# EAGLE schematic BRAIN2_Breakout_SW (EAGLE 6.6.0)
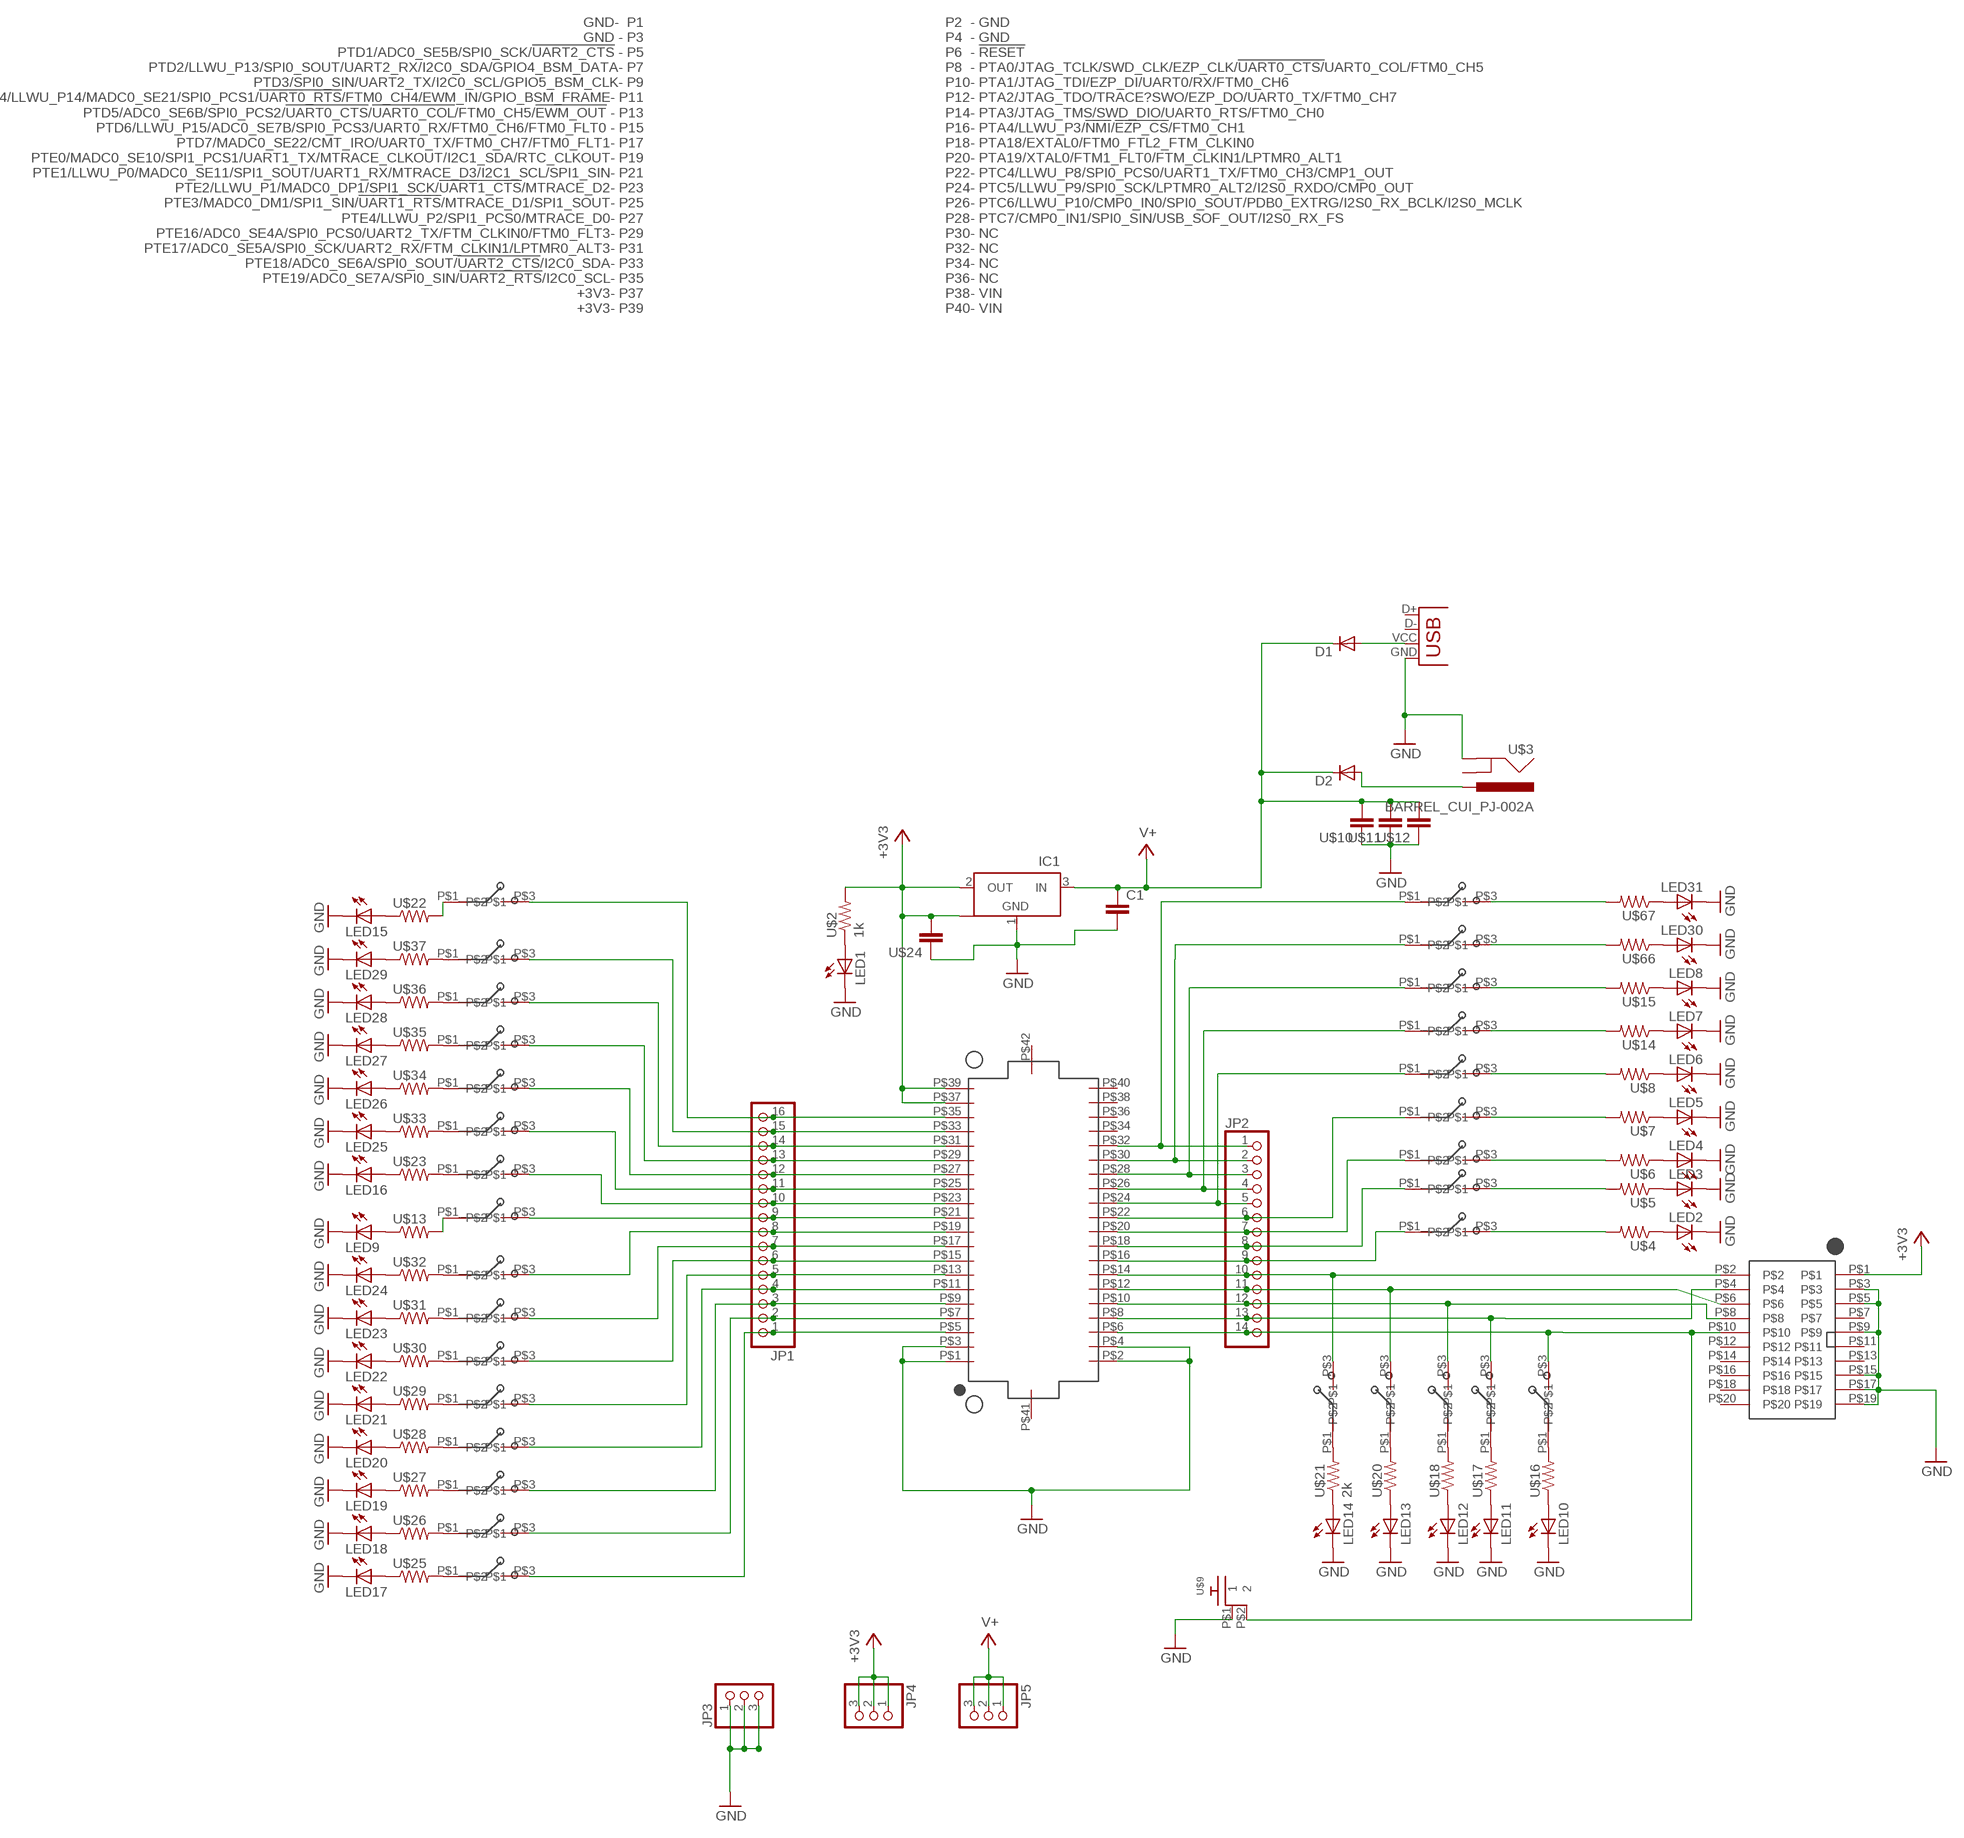
[diagram p0: schematic, sheet 1]

## Parts
C1  RF-C0805  [C0805]
D1  DIODESMA  [SMA-DIODE]
D2  DIODESMA  [SMA-DIODE]
IC1  NCP1117ST33T3G_1  [SOT223]
JP1  PINHD-1X16  [1X16]
JP2  PINHD-1X14  [1X14]
JP3  PINHD-1X3  [1X03]
JP4  PINHD-1X3  [1X03]
JP5  PINHD-1X3  [1X03]
LED1  LEDCHIP-LED0805  [CHIP-LED0805]
LED2  LEDCHIP-LED0805  [CHIP-LED0805]
LED3  LEDCHIP-LED0805  [CHIP-LED0805]
LED4  LEDCHIP-LED0805  [CHIP-LED0805]
LED5  LEDCHIP-LED0805  [CHIP-LED0805]
LED6  LEDCHIP-LED0805  [CHIP-LED0805]
LED7  LEDCHIP-LED0805  [CHIP-LED0805]
LED8  LEDCHIP-LED0805  [CHIP-LED0805]
LED9  LEDCHIP-LED0805  [CHIP-LED0805]
LED10  LEDCHIP-LED0805  [CHIP-LED0805]
LED11  LEDCHIP-LED0805  [CHIP-LED0805]
LED12  LEDCHIP-LED0805  [CHIP-LED0805]
LED13  LEDCHIP-LED0805  [CHIP-LED0805]
LED14  LEDCHIP-LED0805  [CHIP-LED0805]
LED15  LEDCHIP-LED0805  [CHIP-LED0805]
LED16  LEDCHIP-LED0805  [CHIP-LED0805]
LED17  LEDCHIP-LED0805  [CHIP-LED0805]
LED18  LEDCHIP-LED0805  [CHIP-LED0805]
LED19  LEDCHIP-LED0805  [CHIP-LED0805]
LED20  LEDCHIP-LED0805  [CHIP-LED0805]
LED21  LEDCHIP-LED0805  [CHIP-LED0805]
LED22  LEDCHIP-LED0805  [CHIP-LED0805]
LED23  LEDCHIP-LED0805  [CHIP-LED0805]
LED24  LEDCHIP-LED0805  [CHIP-LED0805]
LED25  LEDCHIP-LED0805  [CHIP-LED0805]
LED26  LEDCHIP-LED0805  [CHIP-LED0805]
LED27  LEDCHIP-LED0805  [CHIP-LED0805]
LED28  LEDCHIP-LED0805  [CHIP-LED0805]
LED29  LEDCHIP-LED0805  [CHIP-LED0805]
LED30  LEDCHIP-LED0805  [CHIP-LED0805]
LED31  LEDCHIP-LED0805  [CHIP-LED0805]
U$1  KW2_CPU_NEW  [BRAIN_NEW]
U$2  1k  RF-R0805  [RF-C0805]
U$3  BARREL_CUI_PJ-002A  [BARREL_CUI_PJ-002A]
U$4  RF-R0805  [RF-C0805]
U$5  RF-R0805  [RF-C0805]
U$6  RF-R0805  [RF-C0805]
U$7  RF-R0805  [RF-C0805]
U$8  RF-R0805  [RF-C0805]
U$9  RA_BUTTON  [RA_BUTTON]
U$10  RF-C0805  [C0805]
U$11  RF-C0805  [C0805]
U$12  RF-C0805  [C0805]
U$13  RF-R0805  [RF-C0805]
U$14  RF-R0805  [RF-C0805]
U$15  RF-R0805  [RF-C0805]
U$16  RF-R0805  [RF-C0805]
U$17  RF-R0805  [RF-C0805]
U$18  RF-R0805  [RF-C0805]
U$19  2X10JTAG  [2X10JTAG]
U$20  RF-R0805  [RF-C0805]
U$21  2k  RF-R0805  [RF-C0805]
U$22  RF-R0805  [RF-C0805]
U$23  RF-R0805  [RF-C0805]
U$24  RF-C0805  [C0805]
U$25  RF-R0805  [RF-C0805]
U$26  RF-R0805  [RF-C0805]
U$27  RF-R0805  [RF-C0805]
U$28  RF-R0805  [RF-C0805]
U$29  RF-R0805  [RF-C0805]
U$30  RF-R0805  [RF-C0805]
U$31  RF-R0805  [RF-C0805]
U$32  RF-R0805  [RF-C0805]
U$33  RF-R0805  [RF-C0805]
U$34  RF-R0805  [RF-C0805]
U$35  RF-R0805  [RF-C0805]
U$36  RF-R0805  [RF-C0805]
U$37  RF-R0805  [RF-C0805]
U$38  CJS  [CJS]
U$39  CJS  [CJS]
U$40  CJS  [CJS]
U$41  CJS  [CJS]
U$42  CJS  [CJS]
U$43  CJS  [CJS]
U$44  CJS  [CJS]
U$45  CJS  [CJS]
U$46  CJS  [CJS]
U$47  CJS  [CJS]
U$48  CJS  [CJS]
U$49  CJS  [CJS]
U$50  CJS  [CJS]
U$51  CJS  [CJS]
U$52  CJS  [CJS]
U$53  CJS  [CJS]
U$54  CJS  [CJS]
U$55  CJS  [CJS]
U$56  CJS  [CJS]
U$57  CJS  [CJS]
U$58  CJS  [CJS]
U$59  CJS  [CJS]
U$60  CJS  [CJS]
U$61  CJS  [CJS]
U$62  CJS  [CJS]
U$63  CJS  [CJS]
U$64  CJS  [CJS]
U$65  CJS  [CJS]
U$66  RF-R0805  [RF-C0805]
U$67  RF-R0805  [RF-C0805]
U$68  CJS  [CJS]
U$69  CJS  [CJS]
X1  USB  [USB3076-30-A]

## Nets
+3V3: IC1.2(OUT) IC1.4(OUT1) JP4.1 JP4.2 JP4.3 U$1.P$37(+3V3) U$1.P$39(+3V3) U$2.2 U$19.P$1 U$24.2
GND: C1.2 IC1.1(GND) JP3.1 JP3.2 JP3.3 LED1.C LED2.C LED3.C LED4.C LED5.C LED6.C LED7.C LED8.C LED9.C LED10.C LED11.C LED12.C LED13.C LED14.C LED15.C LED16.C LED17.C LED18.C LED19.C LED20.C LED21.C LED22.C LED23.C LED24.C LED25.C LED26.C LED27.C LED28.C LED29.C LED30.C LED31.C U$1.P$1(GND) U$1.P$2(GND) U$1.P$3(GND) U$1.P$4(GND) U$3.P$2(GND) U$9.P$1 U$10.1 U$11.1 U$12.1 U$19.P$3 U$19.P$5 U$19.P$9 U$19.P$15 U$19.P$17 U$19.P$19 U$24.1 X1.GND
N$1: LED1.A U$2.1
N$2: LED2.A U$4.1
N$3: LED3.A U$5.1
N$4: LED4.A U$6.1
N$5: LED8.A U$15.1
N$6: LED5.A U$7.1
N$7: LED6.A U$8.1
N$8: LED7.A U$14.1
N$9: LED9.A U$13.1
N$10: U$13.2 U$44.P$1
N$11: U$15.2 U$65.P$3
N$12: U$14.2 U$64.P$3
N$13: U$8.2 U$63.P$3
N$14: U$7.2 U$62.P$3
N$15: U$6.2 U$61.P$3
N$16: U$5.2 U$60.P$3
N$17: U$4.2 U$59.P$3
N$18: U$25.2 U$38.P$1
N$19: U$26.2 U$39.P$1
N$20: U$27.2 U$40.P$1
N$21: JP2.3 U$1.P$28(PTC7/CMP0_IN1/SPI0_SIN/USB_SOF_OUT/I2S0_RX_FS) U$65.P$1
N$22: JP2.4 U$1.P$26(PTC6/LLWU_P10/CMP0_IN0/SPI0_SOUT/PDB0_EXTRG/I2S0_RX_BCLK/I2S0_MCLK) U$64.P$1
N$23: JP2.5 U$1.P$24(PTC5/LLWU_P8/SPI0_PCS0/UART1_TX/FTM0_CH3/CMP1_OUT) U$63.P$1
N$24: JP2.6 U$1.P$22(PTC4/LLWU_P8/SPI0_PCS0/UART1_TX/FTM0_CH3/CMP1_OUT) U$62.P$1
N$25: JP2.7 U$1.P$20(PTA19/XTAL0/FTM1_FLT0/FTM_CLKIN1/LPTMR0_ALT1) U$61.P$1
N$26: JP2.8 U$1.P$18(PTA18/EXTAL0/FTM0_FTL2_FTM_CLKIN0) U$60.P$1
N$27: JP2.9 U$1.P$16(PTA4/LLWU_P3/!NMI!/!EZP_CS!/FTM0_CH1) U$59.P$1
N$28: LED15.A U$22.1
N$29: LED17.A U$25.1
N$30: LED18.A U$26.1
N$31: LED19.A U$27.1
N$32: LED20.A U$28.1
N$33: LED16.A U$23.1
N$34: LED25.A U$33.1
N$35: LED26.A U$34.1
N$36: LED27.A U$35.1
N$37: LED21.A U$29.1
N$38: LED22.A U$30.1
N$39: LED23.A U$31.1
N$40: LED24.A U$32.1
N$41: U$28.2 U$41.P$1
N$42: U$29.2 U$42.P$1
N$43: U$31.2 U$43.P$1
N$44: U$37.2 U$46.P$1
N$45: U$36.2 U$47.P$1
N$46: LED28.A U$36.1
N$48: JP2.10 U$1.P$14(PTA3/JTAG_TMS/SWD_DIO/UART0_RTS/FTM0_CH0) U$19.P$2 U$58.P$3
N$49: LED10.A U$16.1
N$50: U$16.2 U$54.P$1
N$52: LED11.A U$17.1
N$53: U$17.2 U$55.P$1
N$54: JP2.12 U$1.P$10(PTA1/JTAG_TDI/EZP_DI/UART0/RX/FTM0_CH6) U$19.P$8 U$56.P$3
N$55: LED12.A U$18.1
N$56: U$18.2 U$56.P$1
N$57: JP2.13 U$1.P$8(PTA0/JTAG_TCLK/SWD_CLK/EZP_CLK/!UART0_CTS/!UART0_COL/FTM0_CH5) U$19.P$4 U$55.P$3
N$58: LED13.A U$20.1
N$59: U$20.2 U$57.P$1
N$60: JP2.14 U$1.P$6(!RESET) U$9.P$2 U$19.P$10 U$54.P$3
N$61: LED14.A U$21.1
N$62: U$21.2 U$58.P$1
N$63: LED29.A U$37.1
N$64: U$22.2 U$45.P$1
N$65: U$35.2 U$48.P$1
N$66: U$34.2 U$49.P$1
N$67: U$33.2 U$50.P$1
N$68: U$23.2 U$51.P$1
N$69: U$32.2 U$52.P$1
N$70: U$30.2 U$53.P$1
N$71: D2.A U$3.P$1(PWR)
N$72: D1.A X1.VCC(VBUS)
N$73: JP2.1 U$1.P$32(NC) U$69.P$1
N$75: LED30.A U$66.1
N$76: LED31.A U$67.1
N$77: U$67.2 U$69.P$3
N$78: U$66.2 U$68.P$3
N$80: JP2.2 U$1.P$30(NC) U$68.P$1
N$86: JP2.11 U$1.P$12(PTA2/JTAG_TDO/TRACE?SWO/EZP_DO/UART0_TX/FTM0_CH7) U$19.P$6 U$57.P$3
PTD1: JP1.1 U$1.P$5(PTD1/ADC0_SE5B/SPI0_SCK/!UART2_CTS) U$38.P$3
PTD2: JP1.2 U$1.P$7(PTD2/LLWU_P13/SPI0_SOUT/UART2_RX/I2C0_SDA/GPIO4_BSM_DATA) U$39.P$3
PTD3: JP1.3 U$1.P$9(PTD3/SPI0_SIN/UART2_TX/I2C0_SCL/GPIO5_BSM_CLK) U$40.P$3
PTD4: JP1.4 U$1.P$11(PTD4/LLWU_P14/MADC0_SE21/SPI0_PCS1/!UART0_RTS!/FTM0_CH4/EWM_IN/GPIO_BSM_FRAME) U$41.P$3
PTD5: JP1.5 U$1.P$13(PTD5/ADC0_SE6B/SPI0_PCS2/!UART0_CTS!/!UART0_COL!/FTM0_CH5/!EWM_OUT) U$42.P$3
PTD6: JP1.6 U$1.P$15(PTD6/LLWU_P15/ADC0_SE7B/SPI0_PCS3/UART0_RX/FTM0_CH6/FTM0_FLT0) U$53.P$3
PTD7: JP1.7 U$1.P$17(PTD7/MADC0_SE22/CMT_IRO/UART0_TX/FTM0_CH7/FTM0_FLT1) U$43.P$3
PTE0: JP1.8 U$1.P$19(PTE0/MADC0_SE10/SPI1_PCS1/UART1_TX/MTRACE_CLKOUT/I2C1_SDA/RTC_CLKOUT) U$52.P$3
PTE1: JP1.9 U$1.P$21(PTE1/LLWU_P0/MADC0_SE11/SPI1_SOUT/UART1_RX/MTRACE_D3/I2C1_SCL/SPI1_SIN) U$44.P$3
PTE2: JP1.10 U$1.P$23(PTE2/LLWU_P1/MADC0_DP1/SPI1_SCK/!UART1_CTS!/MTRACE_D2) U$51.P$3
PTE3: JP1.11 U$1.P$25(PTE3/MADC0_DM1/SPI1_SIN/!UART1_RTS!/MTRACE_D1/SPI1_SOUT) U$50.P$3
PTE4: JP1.12 U$1.P$27(PTE4/LLWU_P2/SPI1_PCS0/MTRACE_D0) U$49.P$3
PTE16: JP1.13 U$1.P$29(PTE16/ADC0_SE4A/SPI0_PCS0/UART2_TX/FTM_CLKIN0/FTM0_FLT3) U$48.P$3
PTE17: JP1.14 U$1.P$31(PTE17/ADC0_SE5A/SPI0_SCK/UART2_RX/FTM_CLKIN1/LPTMR0_ALT3) U$47.P$3
PTE18: JP1.15 U$1.P$33(PTE18/ADC0_SE6A/SPI0_SOUT/!UART2_CTS!/I2C0_SDA) U$46.P$3
PTE19: JP1.16 U$1.P$35(PTE19/ADC0_SE7A/SPI0_SIN/!UART2_RTS!/I2C0_SCL) U$45.P$3
V+: C1.1 D1.C D2.C IC1.3(IN) JP5.1 JP5.2 JP5.3 U$10.2 U$11.2 U$12.2
Unconnected: U$1.P$34(NC) U$1.P$36(NC) U$1.P$38(VIN) U$1.P$40(VIN) U$1.P$41 U$1.P$42 U$3.P$3(GNDBREAK) U$19.P$7 U$19.P$11 U$19.P$12 U$19.P$13 U$19.P$14 U$19.P$16 U$19.P$18 U$19.P$20 X1.D+ X1.D-

## Library data of the parts
C1 U$12 U$24 = GW-devices:RF-C: RF capacitor pads for FSL reference design; MFGN: Murata; MFGP: GRM219R61E106KA12D
D1 D2 = SparkFun:DIODE: Diode These are standard reverse protection diodes and small signal diodes. SMA package can handle up to about 1A. SOD-323 can handle about 200mA. What the SOD-323 package when ordering, there are some mfgs out there that are 5-pin packages.; MFGN: Diodes Inc; MFGP: SBRT3U45SA-13
IC1 = KW2:NCP1117ST33T3G_1: VOLTAGE REGULATOR; MFGN: OnSemi; MFGP: NCP1117ST33T3G
JP1 = pinhead:PINHD-1X16: PIN HEADER; MFGN: Sullins Connector; MFGP: PRPC016SAAN-RC
JP2 = pinhead:PINHD-1X14: PIN HEADER; MFGN: Sullins Connector; MFGP: PRPC012SAAN-RC
JP3-JP5 = pinhead:PINHD-1X3: PIN HEADER; MFGN: Sullins Connector; MFGP: PRPC003SAAN-RC
LED1 = adafruit:LED: LED OSRAM: - CHIPLED LG R971, LG N971, LY N971, LG Q971, LY Q971, LO R971, LY R971 LH N974, LH R974 LS Q976, LO Q976, LY Q976 LO Q996 - Hyper CHIPLED LW Q18S LB Q993, LB Q99A, LB R99A - SideLED LS A670, LO A670, LY A670, LG A670, LP A670 LB A673, LV A673, LT A673, LW A673 LH A674 LY A675 LS A676, LA A676, LO A676, LY A676, LW A676 LS A679, LY A679, LG A679 - Hyper Micro SIDELED® LS Y876, LA Y876, LO Y876, LY Y876 LT Y87S - SmartLED LW L88C, LW L88S LB L89C, LB L89S, LG L890 LS L89K, LO L89K, LY L89K LS L896, LA L896, LO L896, LY L896 - TOPLED LS T670, LO T670, LY T670, LG T670, LP T670 LSG T670, LSP T670, LSY T670, LOP T670, LYG T670 LG T671, LOG T671, LSG T671 LB T673, LV T673, LT T673, LW T673 LH T674 LS T676, LA T676, LO T676, LY T676, LB T676, LH T676, LSB T676, LW T676 LB T67C, LV T67C, LT T67C, LS T67K, LO T67K, LY T67K, LW E67C LS E67B, LA E67B, LO E67B, LY E67B, LB E67C, LV E67C, LT E67C LW T67C LS T679, LY T679, LG T679 LS T770, LO T770, LY T770, LG T770, LP T770 LB T773, LV T773, LT T773, LW T773 LH T774 LS E675, LA E675, LY E675, LS T675 LS T776, LA T776, LO T776, LY T776, LB T776 LHGB T686 LT T68C, LB T68C - Hyper Mini TOPLED® LB M676 - Mini TOPLED Santana® LG M470 LS M47K, LO M47K, LY M47K Source: http://www.osram.convergy.de/; MFGN: Wurth Electronics Inc; MFGP: 150080BS75000
LED2-LED31 = adafruit:LED: LED OSRAM: - CHIPLED LG R971, LG N971, LY N971, LG Q971, LY Q971, LO R971, LY R971 LH N974, LH R974 LS Q976, LO Q976, LY Q976 LO Q996 - Hyper CHIPLED LW Q18S LB Q993, LB Q99A, LB R99A - SideLED LS A670, LO A670, LY A670, LG A670, LP A670 LB A673, LV A673, LT A673, LW A673 LH A674 LY A675 LS A676, LA A676, LO A676, LY A676, LW A676 LS A679, LY A679, LG A679 - Hyper Micro SIDELED® LS Y876, LA Y876, LO Y876, LY Y876 LT Y87S - SmartLED LW L88C, LW L88S LB L89C, LB L89S, LG L890 LS L89K, LO L89K, LY L89K LS L896, LA L896, LO L896, LY L896 - TOPLED LS T670, LO T670, LY T670, LG T670, LP T670 LSG T670, LSP T670, LSY T670, LOP T670, LYG T670 LG T671, LOG T671, LSG T671 LB T673, LV T673, LT T673, LW T673 LH T674 LS T676, LA T676, LO T676, LY T676, LB T676, LH T676, LSB T676, LW T676 LB T67C, LV T67C, LT T67C, LS T67K, LO T67K, LY T67K, LW E67C LS E67B, LA E67B, LO E67B, LY E67B, LB E67C, LV E67C, LT E67C LW T67C LS T679, LY T679, LG T679 LS T770, LO T770, LY T770, LG T770, LP T770 LB T773, LV T773, LT T773, LW T773 LH T774 LS E675, LA E675, LY E675, LS T675 LS T776, LA T776, LO T776, LY T776, LB T776 LHGB T686 LT T68C, LB T68C - Hyper Mini TOPLED® LB M676 - Mini TOPLED Santana® LG M470 LS M47K, LO M47K, LY M47K Source: http://www.osram.convergy.de/; MFGN: Kingbright; MFGP: APT2012SECK
U$1 = KW2:KW2_CPU; MFGN: Hirose; MFGP: DF12(3.0)-40DP-0.5V(86)
U$2 = GW-devices:RF-R: RF resistor pads for FSL reference design; MFGN: Panasonic; MFGP: ERJ-6ENF2000V
U$3 = KW2:BARREL_CUI_PJ-002A; MFGN: CUI; MFGP: PJ002-A
U$4-U$8 U$13-U$18 U$20-U$23 U$25-U$37 U$66 U$67 = GW-devices:RF-R: RF resistor pads for FSL reference design; MFGN: Panasonic; MFGP: ERJ-6ENF2001V
U$9 = KW2:RA_BUTTON; MFGN: TE; MFGP: 1825027-5
U$10 = GW-devices:RF-C: RF capacitor pads for FSL reference design; MFGN: TDK; MFGP: C2012X5R1H104K085AA
U$11 = GW-devices:RF-C: RF capacitor pads for FSL reference design; MFGN: TDK; MFGP: C2012X5R1E105K125AA
U$19 = KW2:2X10JTAG; MFGN: CNC Tech; MFGP: 3220-20-0100-00
U$38-U$65 U$68 U$69 = KW2:CJS; MFGN: Copal Electronics Inc; MFGP: CJS-1200TA
X1 = SparkFun:USB: USB Connectors USB-B-PTH is fully proven SKU : PRT-00139 USB-miniB is fully proven SKU : PRT-00587 USB-A-PCB is untested. USB-A-H is throughly reviewed, but untested. Spark Fun Electronics SKU : PRT-00437 USB-B-SMT is throughly reviewed, but untested. Needs silkscreen touching up. USB-A-S has not been used/tested USB-MB-H has not been used/tested; MFGN: GLOBAL CONNECTOR TECHNOLOGY; MFGP: USB3076-30-A